# EasyEDA Pro project stm_boy_proj.epro, board pcb
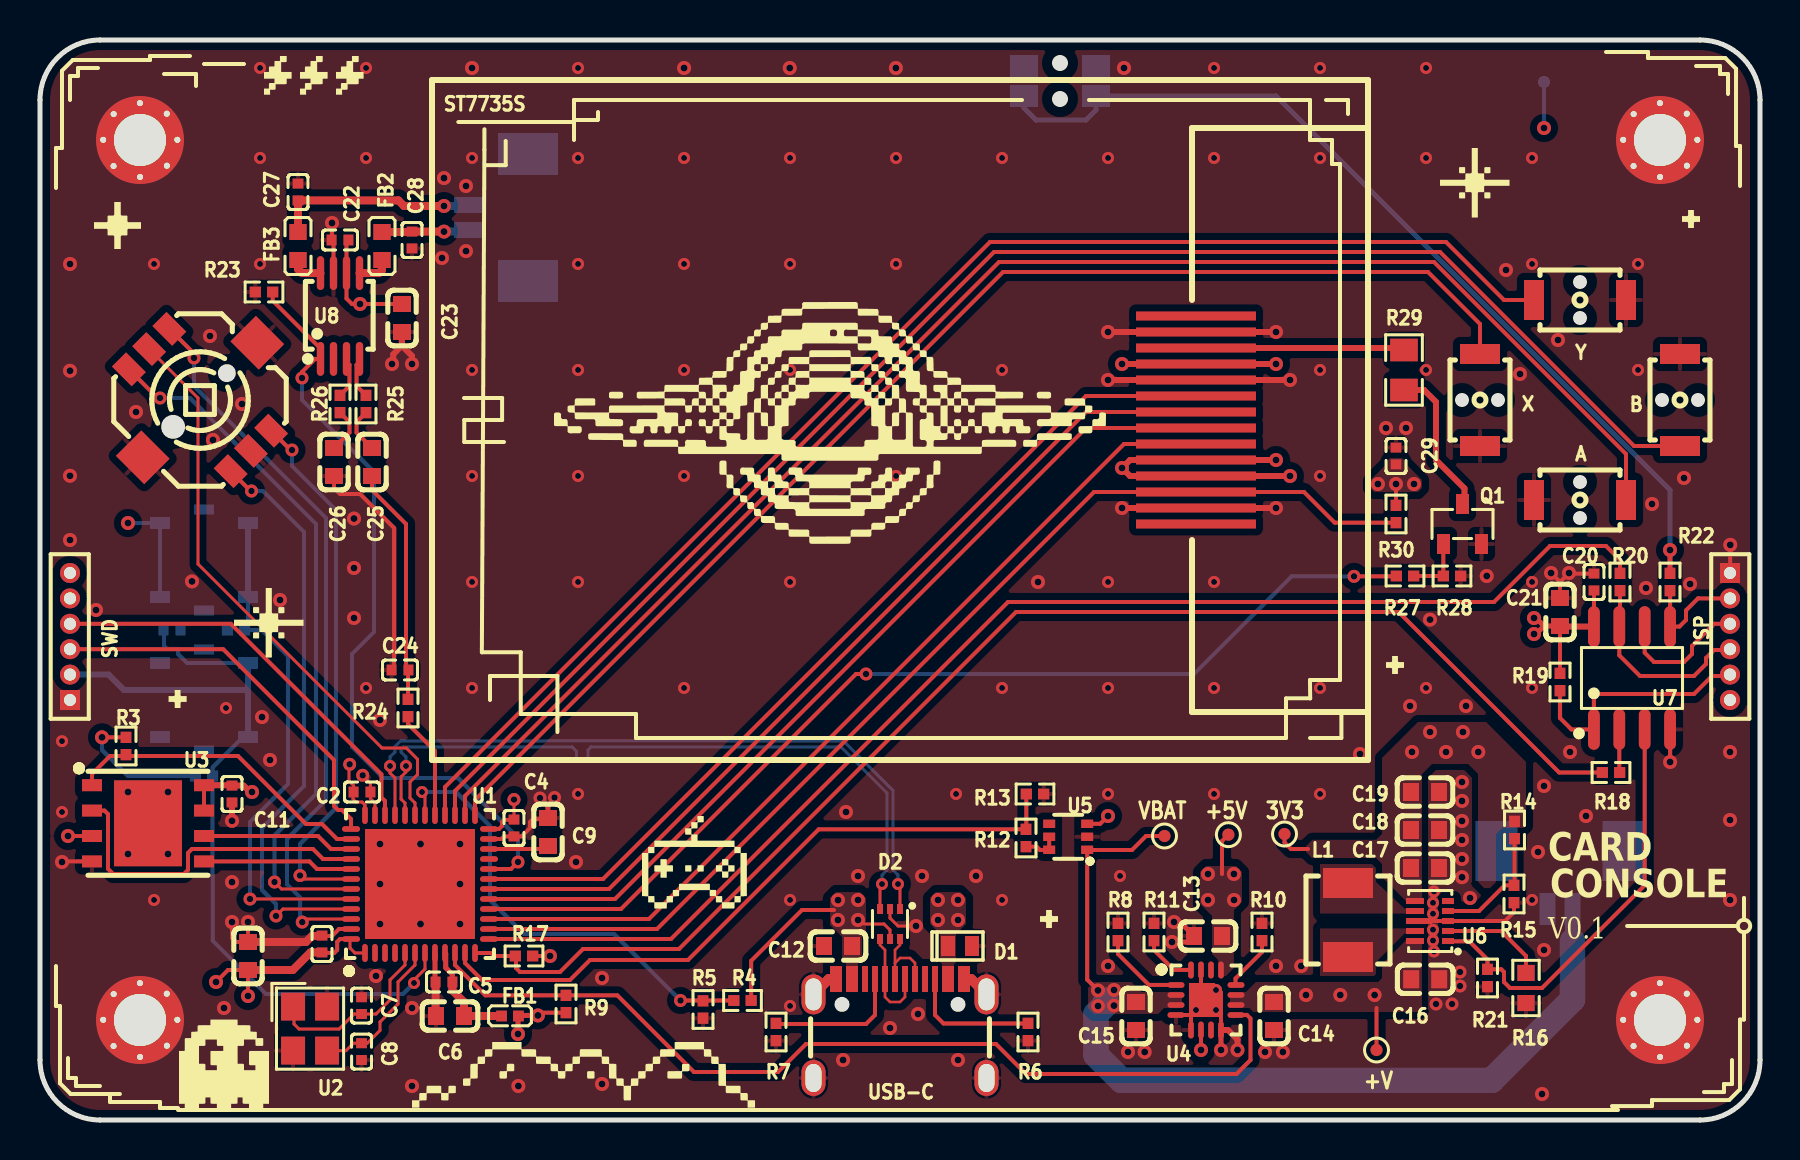
[diagram p3: board, top side]
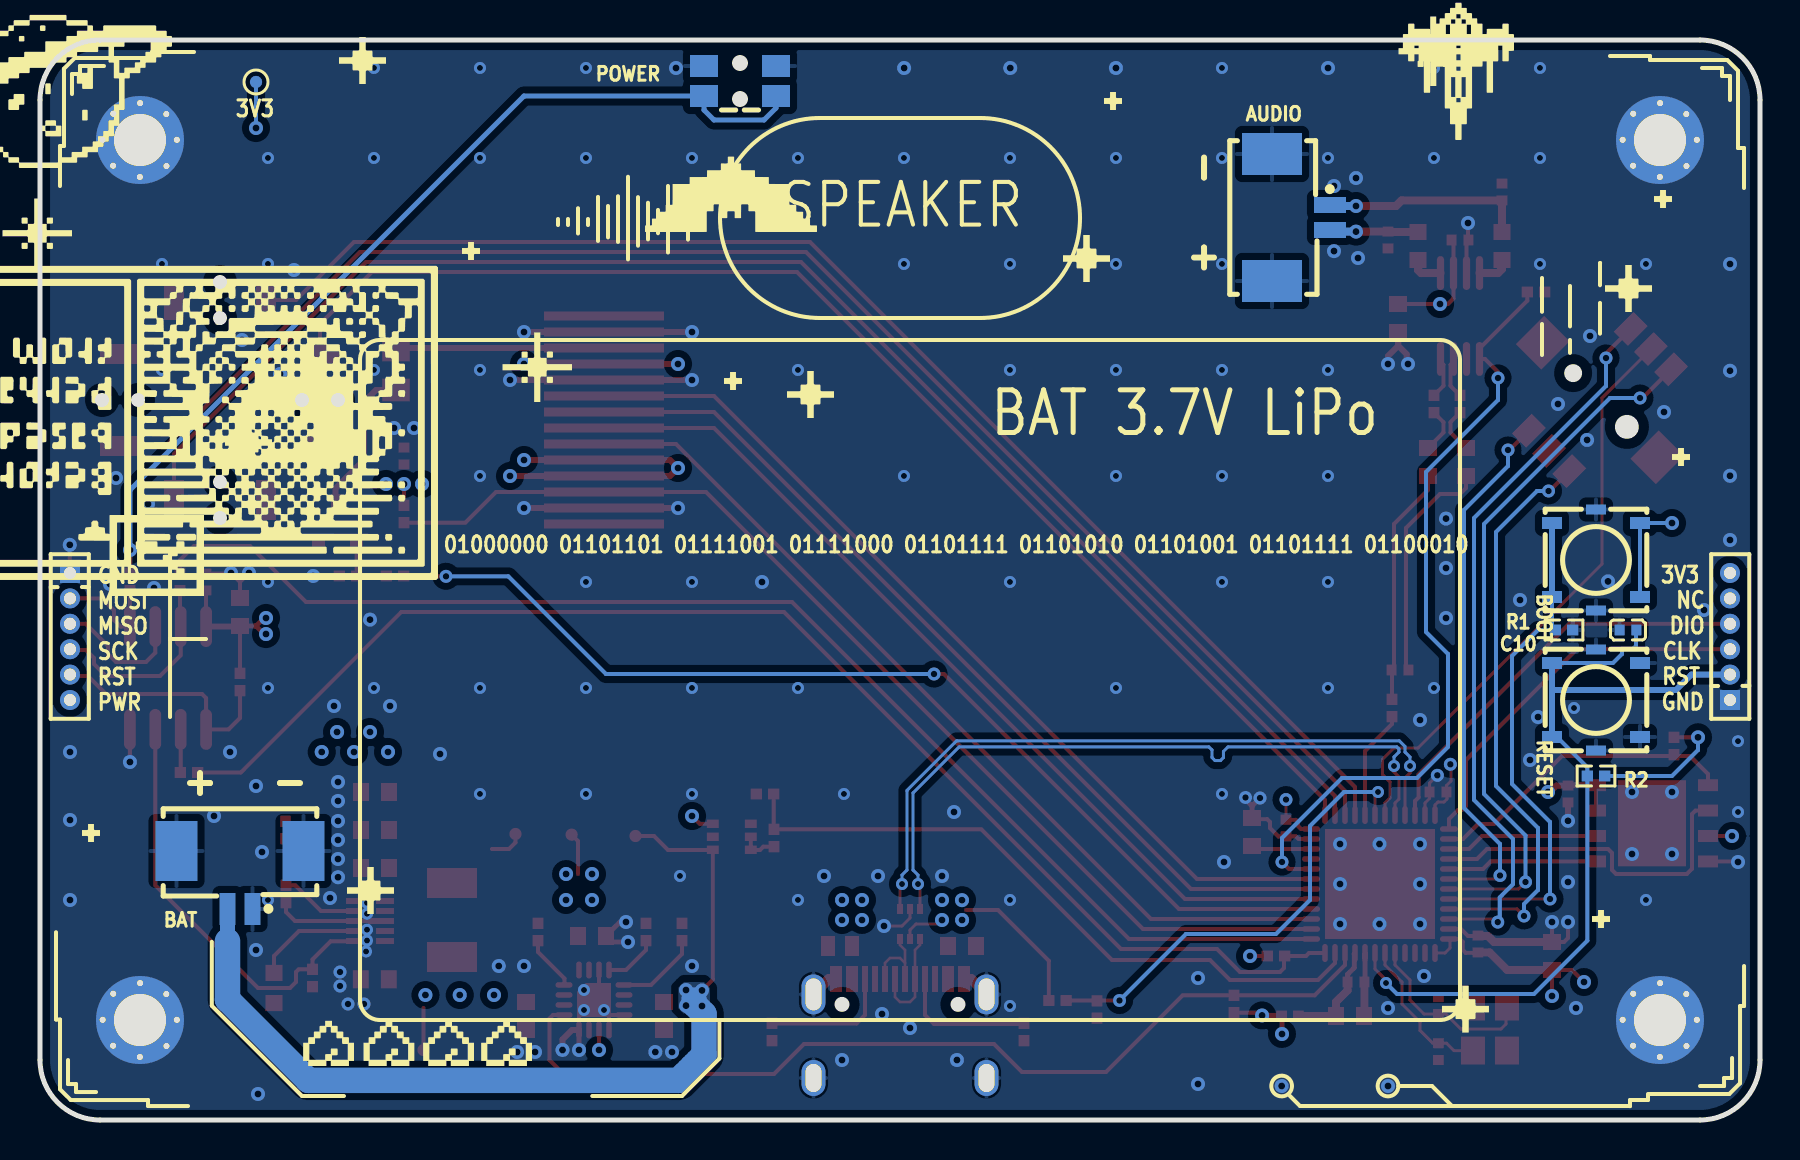
[diagram p4: board, bottom side, seen from below]

Outline 86 x 54 mm; copper layers: Top Layer, Inner1, Inner2, Bottom Layer. Coordinates in mm from the lower left corner of the outline.
Outline path: 0,51 0,3 arc(0.88,0.88) 3,0 83,0 arc(85.12,0.88) 86,3 86,51 arc(85.12,53.12) 83,54 3,54 arc(0.88,53.12) 0,51
Stack: Top Layer 0.018mm Outer layer thickness 1oz / Dielectric1 0.125mm 7628 RC49% 8.6mil / Inner1 0.018mm Inner layer thickness / Dielectric2 1.164mm 1.1mm H/HOZ Copper / Inner2 0.018mm Inner layer thickness / Dielectric3 0.125mm 7628 RC49% 8.6mil / Bottom Layer 0.018mm Outer layer thickness 1oz

## Design rules (mm)
net D+: DP1
net D-: DP1
net $3N1074: DP3
net $3N1073: DP3
net $3N1075: DP4
net $3N1076: DP4
template: User Custom Config
spacing Default (default): track to track 0.125, other pairs 0.13 to 0.4
track width Default (default): min 0.125, default 0.13, max 25.4
differential pair differentialPair (default): width min 0.127, default 0.254, max 2.54; gap min 0.152, default 0.152
via Default (default): diameter min 0.6, default 0.6, max 5; hole min 0.3, default 0.3, max 2

## Placement (name value [footprint] x y rotation side)
A  KAN0444-0201B/102  [SW-SMD_KAN0444-0201B-102]  77 31 180 top
AUDIO  532610271  [CONN-SMD_532610271]  22.95 45.12 90 bottom
B  KAN0444-0201B/102  [SW-SMD_KAN0444-0201B-102]  82 36 90 top
BAT  532610271  [CONN-SMD_532610271]  76 12 180 bottom
BOOT  EVQPLMA15  [KEY-SMD_6P-L4.9-4.9-P3.70]  8.2 28 0 bottom
C1  4.7uF  [C0603]  10.4 8.2 270 top
C2  100nF  [C0402]  16.1 16.4 180 top
C3  100nF  [C0402]  14.1 8.8 270 top
C4  100nF  [C0402]  23.7 14.6 90 top
C5  100nF  [C0402]  20.2 6.9 0 top
C6  1uF  [C0603]  20.5 5.2 180 top
C7  15pF  [C0402]  16.08 5.72 90 top
C8  15pF  [C0402]  16.08 3.42 90 top
C9  4.7uF  [C0603]  25.4 14.4 270 top
C10  100nF  [C0402]  6.6 24.5 180 bottom
C11  100nF  [C0402]  9.6 16.3 270 top
C12  1uF  [C0603]  39.9 8.7 0 top
C13  1uF  [C0603]  58.4 9.2 0 top
C14  4.7uF  [C0603]  61.7 5.2 90 top
C15  4.7uF  [C0603]  54.8 5.2 270 top
C16  10uF  [C0603]  69.26 7.04 180 top
C17  10uF  [C0603]  69.25 12.6 180 top
C18  10uF  [C0603]  69.25 14.5 180 top
C19  10uF  [C0603]  69.25 16.4 180 top
C20  100nF  [C0402]  77.7 26.9 270 top
C21  1uF  [C0603]  76 25.4 270 top
C22  100nF  [C0402]  15 44 0 top
C23  10uF  [C0603]  18.1 40.1 90 top
C24  2.2nF  [C0402]  18 22.5 0 top
C25  1uF  [C0603]  16.6 32.9 90 top
C26  1uF  [C0603]  14.7 32.9 90 top
C27  220pF  [C0402]  12.9 46.4 90 top
C28  220pF  [C0402]  18.6 44 90 top
C29  100nF  [C0402]  67.8 33.2 90 top
D1  ESDA7P60-1U1M  [DFN1610-2L_L1.6-W1.0-P1.10-RD]  46 8.7 0 top
D2  USBLC6-2P6  [SOT-666-6_L1.6-W1.2-P0.50-LS1.6-BL]  42.5 9.8 180 top
FB1  BLM15PX601SN1D  [L0402]  23.5 5.2 180 top
FB2  MPZ1608S101ATAH0  [L0603]  17.1 43.7 90 top
FB3  MPZ1608S101ATAH0  [L0603]  12.9 43.7 90 top
ISP  ISP pads  [6-PIN HEADER SMALL 1.27MM]  84.5 27.35 270 top
L1  470nH  [IND-SMD_L4.4-W4.2_SPM4020T]  65.4 10 90 top
NOREF  -  [Pad_e15262]  56.22 14.2 0 top
NOREF#2  -  [Pad_e15281]  66.83 3.5 0 top
NOREF#3  -  [Pad_e15491]  62.23 14.3 0 top
NOREF#4  -  [Pad_e15184]  75.2 51.9 0 top
NOREF#5  -  [Pad_e15272]  59.42 14.27 0 top
O1  MOUNTING HOLES M2  [MOUNTINGHOLE_2.2MM_M2_PAD_VIA]  5 49 0 top
O2  MOUNTING HOLES M2  [MOUNTINGHOLE_2.2MM_M2_PAD_VIA]  5 5 0 top
O3  MOUNTING HOLES M2  [MOUNTINGHOLE_2.2MM_M2_PAD_VIA]  81 49 0 top
O4  MOUNTING HOLES M2  [MOUNTINGHOLE_2.2MM_M2_PAD_VIA]  81 5 0 top
POWER  EVQP7C01P  [SW-SMD_EVQP7C01P]  51 51.95 0 bottom
Q1  S8050/J3Y/0.4  [SOT-23-3_L2.9-W1.3-P1.90-LS2.4-BR]  71.12 29.8 270 top
R1  10kΩ  [R0402]  9.8 24.5 180 bottom
R2  10kΩ  [R0402]  8.2 17.2 180 bottom
R3  10kΩ  [R0402]  4.3 18.7 270 top
R4  33kΩ  [R0402]  35.12 5.97 0 top
R5  82kΩ  [R0402]  33.15 5.53 90 top
R6  5.1kΩ  [R0402]  49.4 4.4 270 top
R7  5.1kΩ  [R0402]  36.8 4.4 270 top
R8  10kΩ  [R0402]  53.9 9.4 270 top
R9  10kΩ  [R0402]  26.3 5.8 90 top
R10  3.3kΩ  [R0402]  61.1 9.4 270 top
R11  5.1kΩ  [R0402]  55.7 9.4 270 top
R12  33kΩ  [R0402]  49.3 14.1 270 top
R13  82kΩ  [R0402]  49.75 16.3 180 top
R14  56kΩ  [R0402]  73.72 14.5 90 top
R15  10kΩ  [R0402]  73.7 11.3 90 top
R16  0Ω  [R0603]  74.3 6.6 90 top
R17  100kΩ  [R0402]  24.2 8.2 180 top
R18  10kΩ  [R0402]  78.55 17.38 180 top
R19  10kΩ  [R0402]  76 21.9 270 top
R20  10kΩ  [R0402]  79 26.9 90 top
R21  100kΩ  [R0402]  72.38 7.1 90 top
R22  1kΩ  [R0402]  81.5 26.9 270 top
R23  100kΩ  [R0402]  11.2 41.4 180 top
R24  3.3kΩ  [R0402]  18.4 20.6 90 top
R25  10kΩ  [R0402]  16.3 35.8 90 top
R26  10kΩ  [R0402]  15 35.8 90 top
R27  1kΩ  [R0402]  68.25 27.2 0 top
R28  10kΩ  [R0402]  70.6 27.2 0 top
R29  10Ω  [R0805]  68.2 37.5 90 top
R30  10kΩ  [R0402]  67.8 30.3 270 top
RESET  EVQPLMA15  [KEY-SMD_6P-L4.9-4.9-P3.70]  8.2 21 0 bottom
ST7735S  ST7735S_14PIN  [NSP_TFT_1.77_128160_ST7735S_14PIN]  48 35 90 top
SW8  SKRHABE010  [SW-SMD_SKRHABE010]  8 36 315 top
SWD  ST-Link pads  [6-PIN HEADER SMALL 1.27MM]  1.5 21 90 top
U1  STM32F411CEU6  [UFQFPN-48_L7.0-W7.0-P0.50-BL-EP]  19 11.8 0 top
U2  8MHz  [CRYSTAL-SMD_4P-L3.2-W2.5-BL]  13.5 4.57 270 top
U3  W25Q128JVPIQ  [WSON-8_L5.0-W6.0-P1.27-BL-EP]  5.4 14.83 270 top
U4  BQ24075RGTR  [QFN-16_L3.0-W3.0-P0.50-TL-EP1.7]  58.3 6 0 top
U5  TPS22919DCKR  [SC-70-6_L2.2-W1.3-P0.65-LS2.1-BR]  51.41 14.16 0 top
U6  TPS63802DLAR  [VSON-10_L3.0-W2.0-P0.50-TL]  69.57 9.95 180 top
U7  ATTINY13A-SSU  [SOIC-8_L4.9-W3.9-P1.27-LS6.0-BL]  79.6 22.1 0 top
U8  PAM8302AASCR  [MSOP-8_L3.0-W3.0-P0.65-LS5.0-BL]  15 40.2 0 top
USB-C  TYPE-C-31-M-12  [USB-C_SMD-TYPE-C-31-M-12_1]  43 4.57 0 top
X  KAN0444-0201B/102  [SW-SMD_KAN0444-0201B-102]  72 36 270 top
Y  KAN0444-0201B/102  [SW-SMD_KAN0444-0201B-102]  77 41 0 top

## Footprints (pads in the part's own frame, mm; a bottom-side part is the same pattern mirrored in y, then rotated)
6-PIN HEADER SMALL 1.27MM
  rect 1x1 hole 0.605x0.6: 1(0,0)
  round 1 hole 0.605x0.6: 2(1.27,0) 3(2.54,0) 4(3.81,0) 5(5.08,0) 6(6.35,0)
C0402
  rect 0.5x0.54 smd: 1(-0.42,0) 2(0.42,0)
C0603
  rect 0.8x0.9 smd: 1(-0.7,0) 2(0.7,0)
CONN-SMD_532610271
  rect 0.8x1.6 smd: 1(0.625,-1.45) 2(-0.625,-1.45)
  rect 2.1x3 smd: 3(3.175,1.45) 4(-3.175,1.45)
CRYSTAL-SMD_4P-L3.2-W2.5-BL
  rect 1.4x1.2 smd: 1(-1.1,-0.85) 2(1.1,-0.85) 3(1.1,0.85) 4(-1.1,0.85)
DFN1610-2L_L1.6-W1.0-P1.10-RD
  rect 0.7x1 smd: 1(-0.6,0) 2(0.6,0)
IND-SMD_L4.4-W4.2_SPM4020T
  rect 1.5x2.5 smd: 1(-1.85,0) 2(1.85,0)
KEY-SMD_6P-L4.9-4.9-P3.70
  rect 1x0.6 smd: 1(2.2,1.85) 2(-2.2,1.85) 3(-2.2,-1.85) 4(2.2,-1.85)
  rect 1x0.5 smd: 5(0,2.525) 6(0,-2.525)
L0402
  rect 0.54x0.54 smd: 1(-0.42,0) 2(0.42,0)
L0603
  rect 0.8x0.864 smd: 1(-0.7,0) 2(0.7,0)
MOUNTINGHOLE_2.2MM_M2_PAD_VIA
  round 0.61 hole 0.305: 1(-1.841,0.008) 1(-1.323,-1.302) 1(-1.315,1.296) 1(-0.004,1.845) 1(0.005,-1.85) 1(1.339,1.313) 1(1.345,-1.286) 1(1.867,0.009)
  round 4.4 hole 2.6: 1(0,0)
MSOP-8_L3.0-W3.0-P0.65-LS5.0-BL
  oval 0.364x1.692 smd: 1(-0.975,-2.146) 2(-0.325,-2.146) 3(0.325,-2.146) 4(0.975,-2.146) 5(0.975,2.146) 6(0.325,2.146) 7(-0.325,2.146) 8(-0.975,2.146)
NSP_TFT_1.77_128160_ST7735S_14PIN
  rect 0.45x6 smd: 1(5.2,-9.8) 2(4.4,-9.8) 3(3.6,-9.8) 4(2.8,-9.8) 5(2,-9.8) 6(1.2,-9.8) 7(0.4,-9.8) 8(-0.4,-9.8) 9(-1.2,-9.8) 10(-2,-9.8) 11(-2.8,-9.8) 12(-3.6,-9.8) 13(-4.4,-9.8) 14(-5.2,-9.8)
Pad_e15184
  round 0.61 smd far side: TP4(0,0)
Pad_e15262
  round 0.61 smd: TP5(0,0)
Pad_e15272
  round 0.61 smd: TP5(0,0)
Pad_e15281
  round 0.61 smd: TP5(0,0)
Pad_e15491
  round 0.61 smd: TP5(0,0)
QFN-16_L3.0-W3.0-P0.50-TL-EP1.7
  oval 0.85x0.28 smd: 1(-1.5,0.75) 2(-1.5,0.251) 3(-1.5,-0.249) 4(-1.5,-0.75) 9(1.5,-0.75) 10(1.5,-0.249) 11(1.5,0.251) 12(1.5,0.75)
  oval 0.28x0.85 smd: 5(-0.75,-1.5) 6(-0.25,-1.5) 7(0.25,-1.5) 8(0.75,-1.5) 13(0.75,1.5) 14(0.25,1.5) 15(-0.25,1.5) 16(-0.75,1.5)
  custom 1.7x1.7 smd: 17(0,0.001)
R0402
  rect 0.566x0.54 smd: 1(-0.433,0) 2(0.433,0)
R0603
  rect 0.806x0.864 smd: 1(-0.753,0) 2(0.753,0)
R0805
  rect 1.133x1.377 smd: 1(-1,0) 2(1,0)
SC-70-6_L2.2-W1.3-P0.65-LS2.1-BR
  rect 0.6x0.42 smd: 1(0.95,-0.65) 2(0.95,0) 3(0.95,0.65) 4(-0.95,0.65) 5(-0.95,0) 6(-0.95,-0.65)
SOIC-8_L4.9-W3.9-P1.27-LS6.0-BL
  oval 0.588x2.045 smd: 1(-1.905,-2.57) 2(-0.635,-2.57) 3(0.635,-2.57) 4(1.905,-2.57) 5(1.905,2.57) 6(0.635,2.57) 7(-0.635,2.57) 8(-1.905,2.57)
SOT-23-3_L2.9-W1.3-P1.90-LS2.4-BR
  rect 1x0.65 smd: 1(1,-0.95) 2(1,0.95) 3(-1,0)
SOT-666-6_L1.6-W1.2-P0.50-LS1.6-BL
  rect 0.3x0.5 smd: 1(-0.5,-0.75) 2(0,-0.75) 3(0.5,-0.75) 4(0.5,0.75) 5(0,0.75) 6(-0.5,0.75)
SW-SMD_EVQP7C01P
  rect 1.4x1.1 smd: 1(-1.8,0.75) 1`(1.8,0.75) 2(-1.8,-0.75) 2`(1.8,-0.75)
SW-SMD_KAN0444-0201B-102
  rect 1x2 smd: 1(-2.3,0) 2(2.3,0)
SW-SMD_SKRHABE010
  rect 1.4x1 smd: 1(-3.6,1.43) 2(-3.6,0) 3(-3.6,-1.43) 4(3.6,1.43) 5(3.599,0) 6(3.6,-1.43)
  rect 2x1.8 smd: 7(-0.001,4.05) 8(-0.001,-4.05)
UFQFPN-48_L7.0-W7.0-P0.50-BL-EP
  oval 0.28x0.9 smd: 1(-2.751,-3.45) 2(-2.251,-3.45) 3(-1.75,-3.45) 4(-1.25,-3.45) 5(-0.749,-3.45) 6(-0.249,-3.45) 7(0.249,-3.45) 8(0.75,-3.45) 9(1.25,-3.45) 10(1.75,-3.45) 11(2.251,-3.45) 12(2.751,-3.45) 25(2.751,3.449) 26(2.251,3.449) 27(1.75,3.449) 28(1.25,3.449) 29(0.75,3.449) 30(0.249,3.449) 31(-0.249,3.449) 32(-0.749,3.449) 33(-1.25,3.449) 34(-1.75,3.449) 35(-2.251,3.449) 36(-2.751,3.449)
  oval 0.9x0.28 smd: 13(3.45,-2.751) 14(3.45,-2.251) 15(3.45,-1.75) 16(3.45,-1.25) 17(3.45,-0.75) 18(3.45,-0.249) 19(3.45,0.249) 20(3.45,0.749) 21(3.45,1.25) 22(3.45,1.75) 23(3.45,2.251) 24(3.45,2.751) 37(-3.449,2.751) 38(-3.449,2.251) 39(-3.449,1.75) 40(-3.449,1.25) 41(-3.449,0.749) 42(-3.449,0.249) 43(-3.449,-0.249) 44(-3.449,-0.75) 45(-3.449,-1.25) 46(-3.449,-1.75) 47(-3.449,-2.251) 48(-3.449,-2.751)
  rect 5.5x5.5 smd: 49(0,0)
USB-C_SMD-TYPE-C-31-M-12_1
  oval 1.2x2 hole 0.8x1.6: 1(4.325,1.706) 4(-4.325,1.706)
  oval 1.2x1.8 hole 0.8x1.4: 2(4.325,-2.474) 3(-4.325,-2.474)
  custom 0.6x1.3 smd: A1B12(-3.2,2.474) A4B9(-2.4,2.474) B1A12(3.2,2.474) B4A9(2.401,2.474)
  rect 0.3x1.3 smd: A5(-1.25,2.474) A6(-0.25,2.474) A7(0.25,2.474) A8(1.25,2.474) B5(1.75,2.474) B6(0.75,2.474) B7(-0.75,2.474) B8(-1.75,2.474)
VSON-10_L3.0-W2.0-P0.50-TL
  rect 0.6x0.3 smd: 1(-0.825,1) 2(-0.825,0.5) 3(-0.825,0) 4(-0.825,-0.5) 5(-0.825,-1)
  rect 0.9x0.3 smd: 6(0.825,-1) 7(0.825,-0.5) 9(0.825,0.5) 10(0.825,1)
  rect 1.3x0.3 smd: 8(0.625,0)
WSON-8_L5.0-W6.0-P1.27-BL-EP
  rect 0.6x1 smd: 1(-1.905,-2.8) 2(-0.635,-2.8) 3(0.635,-2.8) 4(1.905,-2.8) 5(1.905,2.8) 6(0.635,2.8) 7(-0.635,2.8) 8(-1.905,2.8)
  rect 4.3x3.4 smd: 9(0,0)

## Nets
3V3: BOOT.2 BOOT.3 C1.2 C2.2 C3.2 C4.2 C11.1 C17.2 C18.2 C19.2 C22.2 C23.2 C29.1 FB1.1 NOREF#3.TP5 NOREF#4.TP4 R2.2 R3.1 R9.1 R14.2 R17.1 R30.1 ST7735S.4 ST7735S.10 ST7735S.11 SWD.6 U1.1 U1.24 U1.36 U1.48 U3.3 U3.7 U3.8 U5.3 U6.6 U8.6
+5V: C12.2 C13.2 D1.1 D2.5 NOREF#5.TP5 R4.2 U4.6 U4.13 USB-C.A4B9 USB-C.B4A9
GND: A.2 AUDIO.3 AUDIO.4 B.2 BAT.1 BAT.3 BAT.4 BOOT.5 BOOT.6 C1.1 C2.1 C3.1 C4.1 C5.1 C6.2 C7.2 C8.1 C9.1 C10.1 C11.2 C12.1 C13.1 C14.1 C15.2 C16.1 C17.1 C18.1 C19.1 C20.1 C21.1 C22.1 C23.1 C24.1 C26.1 C27.2 C28.1 C29.2 D1.2 D2.2 ISP.1 O1.1 O2.1 O3.1 O4.1 POWER.2 POWER.2` Q1.2 R1.2 R5.1 R6.2 R7.2 R8.1 R10.1 R11.1 R13.1 R15.1 R16.1 R21.1 R23.2 R28.2 RESET.2 RESET.3 RESET.5 RESET.6 ST7735S.2 ST7735S.5 ST7735S.13 SW8.5 SW8.7 SW8.8 SWD.1 U1.8 U1.23 U1.35 U1.47 U1.49 U2.2 U2.4 U3.4 U3.9 U4.4 U4.5 U4.8 U4.15 U4.17 U5.2 U6.3 U6.8 U7.4 U8.7 USB-C.1 USB-C.2 USB-C.3 USB-C.4 USB-C.A1B12 USB-C.B1A12 X.2 Y.2
VBAT: BAT.2 C15.1 NOREF.TP5 U4.2 U4.3 U5.1
VBUS: R4.1 R5.2 U1.30
+V: C14.2 C16.2 C20.2 C21.2 ISP.6 NOREF#2.TP5 R19.1 U4.10 U4.11 U6.10 U7.8
A_BTN: A.1 U1.26
AMP_SD: R23.1 U1.20 U8.1
AUDIO_PWM: R24.1 U1.29
B_BTN: B.1 U1.27
BAT_STAT: R12.1 R13.2 U1.11
BLK: R27.1 U1.16
BOOT0: BOOT.1 BOOT.4 R1.1 U1.44
CE_BTN: SW8.2 U1.31
CHRG_STAT: R9.2 U1.10 U4.9
CS_D: R30.2 ST7735S.12 U1.14
CS_F: R3.2 U1.38 U3.1
D+: D2.1 U1.33
D-: D2.3 U1.32
DC: ST7735S.7 U1.18
DN: D2.4 USB-C.A7 USB-C.B7
DOWN_BTN: SW8.6 U1.45
DP: D2.6 USB-C.A6 USB-C.B6
EN: R21.2 U6.1 U7.3
ISP_MISO: ISP.3 U7.6
ISP_MOSI: ISP.2 R22.2 U7.5
ISP_RST: ISP.5 R19.2 U7.1
ISP_SCK: ISP.4 R20.1 U7.7
LEFT_BTN: SW8.3 U1.43
MISO_F: U1.40 U3.2
MOSI_D: ST7735S.8 U1.17
MOSI_F: U1.41 U3.5
NRST: C10.2 R2.1 RESET.1 RESET.4 SWD.2 U1.7
OFF_ACK: R20.2 U1.13
OFF_REQ: R17.2 R18.2 U1.12
OSC_IN: C7.1 U1.5 U2.1
OSC_OUT: C8.2 U1.6 U2.3
PWR_BTN: POWER.1 POWER.1` R22.1
RIGHT_BTN: SW8.4 U1.42
RST_D: ST7735S.6 U1.19
SCK_D: ST7735S.9 U1.15
SCK_F: U1.39 U3.6
SWCLK: SWD.3 U1.37
SWDIO: SWD.4 U1.34
UP_BTN: SW8.1 U1.46
VCAP: C9.2 U1.22
VDDA/VREF+: C5.2 C6.1 FB1.2 U1.9
X_BTN: U1.25 X.1
Y_BTN: U1.28 Y.1
$2N4: R14.1 R15.2 U6.4
$2N16: L1.1 U6.9
$2N17: L1.2 U6.7
$2N28: R11.2 U4.16
$2N40: R7.1 USB-C.A5
$2N41: R6.1 USB-C.B5
$2N60: R18.1 U7.2
$2N62: R16.2 U6.2
$2N64: R12.2 U5.5 U5.6
$2N975: R8.2 U4.1
$2N6281: R10.2 U4.12
$3N1044: AUDIO.2 C28.2 FB2.2
$3N1045: AUDIO.1 C27.1 FB3.2
$3N1049: Q1.3 R29.1
$3N1051: Q1.1 R27.2 R28.1
$3N1059: FB2.1 U8.5
$3N1060: FB3.1 U8.8
$3N1062: R29.2 ST7735S.3
$3N1072: C24.2 C25.1 R24.2
$3N1073: C26.2 R26.1
$3N1074: C25.2 R25.1
$3N1075: R25.2 U8.4
$3N1076: R26.2 U8.3

Pads without a net: ST7735S 1 14; SWD 5; U1 2 3 4 21; U4 7 14; U5 4; U6 5; U8 2; USB-C A8 B8

## Via types
v1: diameter 0.7, hole 0.35, Top Layer to Bottom Layer, 165 vias
v2: diameter 0.65, hole 0.325, Top Layer to Bottom Layer, 23 vias
v3: diameter 0.6, hole 0.3, Top Layer to Bottom Layer, 84 vias

## Routing (per net, layer and track width the routed paths; a pad name or vN(x,y) marks a point on that pad's centre or on a via; arc(x,y) is an arc through that point)
3V3: length 74
  Top Layer w0.15: U1.48 15.5,9 15.5,8.6 15.75,8.35 U1.1 ; v2(15.48,17.78) 15.45,17.75 15.45,16.95 15.68,16.72 C2.2 15.65,16.37 15.65,16.05 15.8,15.9 16.1,15.9 16.25,15.75 U1.36 ; C4.2 v2(23.7,16.02)
  Top Layer w0.2: U1.24 22.95,14.55 23.1,14.7 23.1,14.9 23.21,15.01 23.69,15.01 C4.2
  Top Layer w0.201: C23.2 v1(16,40.8) 15.6,40.8 15.33,41.08 U8.6 15.33,43.91 C22.2 ; v1(10.4,6.2) C1.2 9.4,7.5 v1(8.8,6.9) ; 63.4,13.55 62.55,13.55 62.23,13.87 NOREF#3.TP5 ; v1(67.8,31.8) R30.1 ; 4.3,19.13 v1(3.1,19.13) ; R17.1 v1(25.5,8.2) ; U3.3 v1(1.4,14.2) ; 26.3,5.37 25.04,5.37 v1(24.9,5.23) ; 8.2,15.37 8.2,16.64 ; U1.48 15,9.05 14.86,8.91 14.86,8.5 14.72,8.36 14.12,8.36 C3.2 ; 52.36,14.81 53.01,14.81 v1(53.4,15.2)
  Top Layer w0.249: v1(24.9,5.23) 23.95,5.23 FB1.1 23.9,5.18 v1(23.9,4.3)
  Top Layer w0.299: v1(54.1,37.8) ST7735S.4 v1(61.8,37.8) ; v1(62.5,32.2) ST7735S.11 54.5,32.2 v1(54.1,32.6) 54.5,33 ST7735S.10 v1(61.8,33)
  Top Layer w0.3: v1(10.6,16.4) 10.5,16.4 10.18,16.72 C11.1 9.58,16.74 U3.8
  Top Layer w0.4: C3.2 13.52,8.38 12.64,7.5 C1.2
  Bottom Layer w0.201: v1(4.4,29.85) BOOT.3 BOOT.2 ; NOREF#4.TP4 v1(75.2,49.6) ; v1(3.1,19.13) 3.1,18.5 4.4,17.2 R2.2
  vias: v1(66.9,31.8) v1(68.6,18.4) v1(68.7,31.8) v1(69.5,19.4) v1(70.3,18.4) v1(71.15,19.4) v1(71.92,18.4)
+5V: length 12.2
  Top Layer w0.15: 41.2,9.8 42.2,9.8 42.5,9.5 D2.5
  Top Layer w0.201: U4.6 v1(58.05,3.5) ; NOREF#5.TP5 59.1,13.95 59.1,12.3 ; 39.7,10.5 38.1,10.5 35.56,7.96 R4.2
  vias: v1(39.9,10.99) v1(39.9,10) v1(40.9,11) v1(40.9,10) v1(44.9,11) v1(44.9,10) v1(45.9,11) v1(45.9,10) v1(58.4,12.3) v1(58.4,11) v1(59.69,12.3) v1(59.7,11)
GND: length 91.8
  Top Layer w0.15: D2.2 42.5,10.1 42.9,9.7 v1(43.8,9.7) ; U1.35 16.75,15.85 16.52,16.08 C2.1 16.52,16.85 v2(16.13,17.23)
  Top Layer w0.2: U1.23 23.07,14.05 23.2,14.18 C4.1
  Top Layer w0.201: U4.5 57.55,5.25 U4.4 ; v1(10.4,9.9) 10.4,9 ; 10.4,9 10.3,8.9 9.8,8.9 9.6,9.1 v1(9.6,9.9) ; 10.4,9 10.45,8.95 C1.1 ; C4.1 24.08,14.18 24.5,14.6 24.5,14.9 24.64,15.04 25.34,15.04 C9.1 ; U8.7 14.67,43.9 C22.1 14.6,44.02 v1(14.6,44.85) ; 76,26.9 v1(76.45,27.35) 76.48,27.32 C20.1 ; C21.1 76,26.9 v1(75.55,27.35) ; U4.8 59.05,5.25 v3(58.8,5.5) U4.17 ; U4.17 v3(57.8,5.5) ; U4.17 58.05,6.25 U4.15 ; v1(1.1,12.9) 1.13,12.93 U3.4 ; 73.7,10.87 73.7,10.4 73.25,9.95 U6.3 U6.8 ; ISP.1 84.51,27.36 v1(84.51,28.76) ; U1.47 14.95,9.55 14.6,9.2 14.12,9.2 C3.1 ; C26.1 14.7,31.6 15,31.3 16,31.3 17.7,29.6 17.7,22.62 C24.1
  Top Layer w0.203: U7.4 v1(81.5,17.9)
  Top Layer w0.249: C9.1 25.39,15.11 25.39,15.69 25.4,15.7 ; U1.8 19.75,6.93 C5.1 ; 25.4,15.7 v2(25,16.1) ; 25.4,15.7 25.72,16.03 v2(25.72,16.12) ; v1(56.6,8.9) 57.4,8.9 C13.1 57,9.9 v1(56.7,9.9)
  Top Layer w0.25: U4.8 v1(59.05,3.5)
  Top Layer w0.299: v1(54.1,30.6) ST7735S.13 v1(61.8,30.6) ; v1(61.8,39.4) ST7735S.2 v1(53.4,39.4) ; v1(62.5,37) ST7735S.5 v1(53.4,37) ; 18.1,38.7 18.1,39.5 18.09,39.49 18.09,38.71 ; 18.1,38.7 18.09,38.7 18.09,38.71 ; 18.1,38.7 18.6,38.2 v1(18.6,37.8) ; 18.09,38.71 17.66,38.29 17.66,37.86 v1(17.6,37.8) ; v1(59.88,3.5) 59.88,4.03 59.4,4.5 U4.8
  Top Layer w0.3: v1(9.6,14.96) C11.2
  Top Layer w0.399: C5.1 19.78,5.28 19.7,5.2
  Top Layer w0.4: C3.1 14.08,9.2 13.6,9.2 13.3,8.9 C1.1
  Top Layer w0.5: USB-C.B1A12 46.56,7.05 USB-C.1 ; USB-C.A1B12 39.44,7.05 USB-C.4
  vias: v1(1.5,42.8) v1(1.5,37.46) v1(1.5,32.21) v1(1.5,29) v1(2.8,25.5) v1(4.4,16.4) v1(4.4,13.3) v1(4.8,35.4) v1(6.4,16.4) v1(6.4,13.3) v1(7.6,26.93) v1(8.5,39.2) v1(8.64,34) v1(9.2,5.6) v1(9.6,11.9) v1(10.1,35.8) v1(11.1,20.15) v1(11.5,18) v1(12,26) v1(15.7,30.07) v1(15.7,27.6) v1(15.7,25.1) v1(16.8,7.2) v1(17,20) v1(17,13.8) v1(17,11.8) v1(17,9.8) v1(18.6,5.6) v1(18.6,1.7) v1(19.03,13.8) v1(19.03,9.8) v1(20.1,43.1) v1(20.2,47.1) v1(21,13.8) v1(21,11.8) v1(21,9.8) v1(21.3,46.7) v1(21.3,43.44) v1(21.6,52.6) v1(23.92,1.7) v1(26.8,12.9) v1(28.1,7.1) v1(28.1,1.8) v1(32.2,52.6) v1(37.49,52.6) v1(40.15,3) v1(40.3,15.4) v1(40.9,12.2) v1(42.5,4.6) v1(42.79,52.6) v1(43.9,5.3) v1(44.1,12.2) v1(45.9,3) v1(46.8,12.2) v1(49.9,26.9) v1(53.4,7.7) v1(54.2,52.6) v1(54.4,3.4) v1(55.23,3.4) v1(61.25,3.4) v1(61.8,7.7) v1(62.14,3.4) v1(63.06,7.7) v1(66,18.3) v1(67.3,34.6) v1(68.3,34.6) v1(68.5,20.7) v1(69.5,25.02) v1(71.1,16.9) v1(71.1,15.95) v1(71.1,14.95) v1(71.1,14) v1(71.1,13.05) v1(71.1,12.14) v1(71.3,20.7) v1(71.5,11.1) v1(72.34,27.2) v1(73.3,42.5) v1(74,37.3) v1(74.9,13.4) v1(75.1,1.3) v1(75.2,16.7) v1(75.2,8.5) v1(75.9,39) v1(76.5,18.4) v1(77.3,15.2) v1(80.3,26.6) v1(80.6,30.8) v1(82.2,32.1) v1(82.5,26.8) v1(84.5,18.4) v1(84.5,15) v1(84.5,11) v2(69.8,5.8) v2(70.6,5.8) v2(71,7.4) v2(71,6.7) v3(1.1,18.94) v3(1.1,15.4) v3(5.7,42.8) v3(5.7,11) v3(9.3,20.6) v3(11,52.6) v3(11,48.1) v3(11,42.8) v3(16.3,52.6) v3(16.3,48.1) v3(16.3,21.6) v3(21.6,48.1) v3(21.6,37.5) v3(21.6,32.2) v3(21.6,26.9) v3(21.6,21.6) v3(26.9,52.6) v3(26.9,48.1) v3(26.9,42.8) v3(26.9,37.5) v3(26.9,32.2) v3(26.9,26.9) v3(26.9,16.3) v3(32.2,48.1) v3(32.2,42.8) v3(32.2,37.5) v3(32.2,32.2) v3(32.2,21.6) v3(37.5,48.1) v3(37.5,42.8) v3(37.5,37.5) v3(37.5,26.9) v3(37.5,11) v3(37.5,5.7) v3(42.8,48.1) v3(42.8,42.8) v3(42.8,32.2) v3(45.8,16.3) v3(48.1,48.1) v3(48.1,37.5) v3(48.1,21.6) v3(48.1,11) v3(53.4,48.1) v3(53.4,26.9) v3(53.4,21.6) v3(53.4,16.3) v3(54,12.2) v3(58.7,52.6) v3(58.7,48.1) v3(58.7,26.9) v3(58.7,21.6) v3(58.7,16.3) v3(58.8,6.5) v3(64,52.6) v3(64,48.1) v3(64,37.5) v3(64,32.2) v3(64,21.6) v3(64,16.3) v3(69.3,52.6) v3(69.3,48.1) v3(69.3,37.5) v3(69.3,21.6) v3(69.7,11.43) v3(69.65,10.86) v3(69.65,10.31) v3(69.65,9.52) v3(69.65,8.97) v3(69.7,8.43) v3(74.6,48.1) v3(74.6,42.8) v3(74.6,26.9) v3(74.6,21.6) v3(74.6,11) v3(79.9,42.8) v3(79.9,37.5)
VBAT: length 44.9
  Top Layer w0.201: NOREF.TP5 55.3,14.2 54.6,13.5 52.37,13.5 52.36,13.51 52.36,7.02 v1(52.9,6.48)
  Bottom Layer w0.75: 76.62,8.95 BAT.2
  Bottom Layer w1.27: 53.3,6 53.3,5.8 52.8,5.3 52.8,3.25 54.07,1.98 72.58,1.98 76.62,6.03 76.62,8.95
  vias: v1(52.9,5.7) v1(53.7,6.5) v1(53.7,5.72)
VBUS: length 23.3
  Top Layer w0.15: v3(19.1,16.4) 19.25,16.25 U1.30
  Top Layer w0.201: R4.1 33.15,5.97 R5.2 33.13,5.97 v2(32.03,5.97)
  Bottom Layer w0.201: v2(32.03,5.97) 28.7,9.3 24.2,9.3 22.5,11 22.5,14.7 20.8,16.4 v3(19.1,16.4)
+V: length 10.1
  Top Layer w0.201: NOREF#2.TP5 66.83,5.6 ; C21.2 76,22.33 ; C20.2 77.7,24.67 U7.8
  Top Layer w0.249: v1(74.7,24.3) 74.8,24.3 75.2,24.7 ; v1(74.7,25.1) 74.8,25.1 75.2,24.7 ; 75.2,24.7 C21.2
  Top Layer w0.299: U7.8 76.03,24.67 C21.2
  vias: v1(63.3,6.25) v1(65.01,6.25) v1(66.73,6.25)
A_BTN: length 76.3
  Top Layer w0.201: A.1 79.3,33.3 69.7,42.9 47.95,42.9 21.25,16.2 U1.26
AMP_SD: length 39.2
  Top Layer w0.201: U1.20 23.55,12.55 v2(23.9,12.9) ; v2(13.1,37.1) 13.1,37.4 13.75,38.05 U8.1 14.03,38.58 11.63,40.97 11.63,41.4
  Bottom Layer w0.201: v2(23.9,12.9) 23.9,14.1 20.9,17.1 17.15,17.1 15.6,18.65 15.6,23.3 16.7,24.4 16.7,32.4 13.1,36 v2(13.1,37.1)
AUDIO_PWM: length 5.5
  Top Layer w0.201: U1.29 19.75,18.45 18.4,19.8 18.4,20.17
B_BTN: length 77.6
  Top Layer w0.201: B.1 79.7,33.7 70,43.4 47.7,43.4 20.75,16.45 U1.27
BAT_STAT: length 33.8
  Top Layer w0.201: U1.11 21.25,7.85 22.1,7 23.18,7 ; 23.2,7 26.5,7 27.5,8 32.4,8 38.93,14.53 R12.1 49.32,14.55 R13.2
BLK: length 52.3
  Top Layer w0.201: v2(41.3,22.3) 40.8,22.3 29.05,10.55 U1.16 ; R27.1 67.8,27.18 v2(65.7,27.18)
  Bottom Layer w0.201: v2(41.3,22.3) 57.7,22.3 62.58,27.18 v2(65.7,27.18)
BOOT0: length 26.1
  Top Layer w0.15: U1.44 v2(10.5,11.05)
  Bottom Layer w0.201: BOOT.1 10.4,24.67 R1.1 11.1,24.5 12.4,23.2 12.4,16.8 10.5,14.9 v2(10.5,11.05)
  Bottom Layer w0.299: BOOT.1 BOOT.4
CE_BTN: length 29.8
  Top Layer w0.15: U1.31 18.75,15.85 18.5,16.1 18.5,16.9 18.88,17.28 18.88,18.04 18.31,18.6 17.1,18.6 7.9,27.8 7.9,36.1 SW8.2
CHRG_STAT: length 47
  Top Layer w0.201: 59.78,5.25 60.35,5.25 60.53,5.07 60.53,3 59.83,2.3 49.3,2.3 47.8,3.8 38.3,3.8 36.9,2.4 32.7,2.4 28.87,6.23 22.27,6.23 20.75,7.75 U1.10
CS_D: length 55
  Top Layer w0.201: 67.8,29.87 64.73,29.87 63.2,31.4 ST7735S.12 52.7,31.4 30.85,9.55 U1.14
CS_F: length 15.6
  Top Layer w0.201: U3.1 2.6,17.3 3.5,18.2 9.9,18.2 13.3,14.8 14.1,14.8 14.85,14.05 U1.38
D+: length 35.7
  Top Layer w0.15: U1.33 17.75,17.1 17.5,17.35 v3(17.5,17.7) ; D2.1 43,11.7 v3(42.9,11.8)
  Bottom Layer w0.15: v3(17.5,17.7) 17.5,18.15 17.75,18.4 17.75,18.67 18.03,18.96 40.17,18.96 42.65,16.48 42.65,12.5 42.9,12.25 v3(42.9,11.8)
D-: length 35.8
  Top Layer w0.15: D2.3 42,11.7 v3(42.1,11.8) ; v3(18.3,17.7) 18.3,17.4 18.05,17.15 18.05,16.05 18.25,15.85 U1.32
  Bottom Layer w0.15: v3(18.3,17.7) 18.3,18.15 18.05,18.4 18.05,18.55 18.16,18.65 26.6,18.65 26.83,18.43 26.83,18.12 26.98,17.97 27.25,17.97 27.4,18.12 27.4,18.5 27.55,18.65 40.05,18.65 42.35,16.35 42.35,12.5 42.1,12.25 v3(42.1,11.8)
DC: length 45.2
  Top Layer w0.201: U1.18 28.45,11.55 52.3,35.4 ST7735S.7
DN: length 5.1
  Top Layer w0.13: USB-C.A7 43.25,6.15 43,5.9 42.5,5.9 42.25,6.15 USB-C.B7 42.25,8.5 42,8.75 D2.4
DOWN_BTN: length 29.2
  Top Layer w0.15: v2(11.8,10.2) 12.15,10.55 U1.45
  Top Layer w0.201: SW8.6 10.53,31.45 v2(10.57,31.45)
  Bottom Layer w0.201: v2(10.57,31.45) 11.15,31.45 13.2,29.4 13.2,16.7 11.1,14.6 11.1,11.5 11.8,10.8 v2(11.8,10.2)
DP: length 4.1
  Top Layer w0.13: 42.75,7.85 43,8.1 43.5,8.1 43.75,7.85 USB-C.B6 ; 42.75,7.85 USB-C.A6 ; 42.75,7.85 42.75,8.5 43,8.75 D2.6
EN: length 21.3
  Top Layer w0.201: 80.24,19.53 80.24,11.73 75.1,6.6 73.5,6.6 73.2,6.9 73.2,7.4 73.07,7.53 R21.2
  Top Layer w0.203: R21.2 72.38,8.03 71.46,8.94 70.39,8.94
ISP_MISO: length 6.8
  Top Layer w0.201: ISP.3 83.71,24.81 82.6,23.7 82.6,23.3 82.2,22.9 80.7,22.9 80.24,23.36 80.24,24.67
ISP_MOSI: length 5.7
  Top Layer w0.201: ISP.2 82.9,26.08 82.3,25.48 82.3,25 81.97,24.67 U7.5 81.5,26.46 R22.2
ISP_RST: length 11.7
  Top Layer w0.201: U7.1 77.69,21.09 77.9,21.3 82.7,21.3 83.6,22.2 84.08,22.2 84.09,22.19
  Top Layer w0.203: R19.2 76,20.1 76.57,19.53 U7.1
ISP_SCK: length 9.9
  Top Layer w0.201: R20.1 79,24.7 U7.7 78.97,23.23 80,22.2 82.7,22.2 83.3,22.8 83.3,23.1 83.7,23.5 84.46,23.5 ISP.4
LEFT_BTN: length 35.3
  Top Layer w0.15: v2(11.73,11.9) 12.07,11.55 U1.43
  Top Layer w0.201: SW8.3 5.88,36.1 v2(6,36.1)
  Bottom Layer w0.201: v2(11.73,11.9) 11.73,14.23 13.8,16.3 13.8,29.8 7.5,36.1 v2(6,36.1)
MISO_F: length 17.1
  Top Layer w0.201: U3.2 3.22,15.47 3.4,15.3 3.4,12.56 3.66,12.3 7.19,12.3 7.4,12.51 7.4,13.35 7.59,13.55 13.65,13.55 14.15,13.05 U1.40
MOSI_D: length 45.1
  Top Layer w0.201: ST7735S.8 52.3,34.6 28.75,11.05 U1.17
MOSI_F: length 7.5
  Top Layer w0.201: U3.5 13.47,12.93 13.85,12.55 U1.41
NRST: length 42.7
  Top Layer w0.15: U1.7 19.25,7.55 18.7,7 v3(18.7,6.85)
  Bottom Layer w0.201: RESET.4 7.35,22.85 6.9,23.3 6.9,23.56 6.34,23.56 6.2,23.7 6.2,24.48 C10.2 ; v3(18.7,6.85) 18.15,6.3 11.3,6.3 8.63,8.97 8.63,17.63 10.2,19.2 10.25,19.15 RESET.1
  Bottom Layer w0.299: RESET.4 10.4,22.27 ; 10.4,21.5 RESET.1
  Bottom Layer w0.3: 10.4,22.27 10.4,21.5 4.2,21.5 3.43,22.27 SWD.2
OFF_ACK: length 65.6
  Top Layer w0.201: 79,27.33 79,28 78.3,28.7 75.5,28.7 72.7,25.9 48.4,25.9 31.55,9.05 U1.13
OFF_REQ: length 67.9
  Top Layer w0.201: 78.12,17.38 75.96,17.38 67.93,25.4 48.8,25.4 31.95,8.55 27.15,8.55 26,7.4 24,7.4 23.8,7.6 23.8,8.17 R17.2 22.7,8.2 22.55,8.35 U1.12
OSC_IN: length 9.1
  Top Layer w0.15: U1.5 18.25,7.75 17.5,7 17.5,6 16.8,5.3 C7.1 15.71,5.3 14.96,4.55 12.95,4.55 12.7,4.8 12.7,5.62 U2.1
OSC_OUT: length 7.7
  Top Layer w0.15: U2.3 15.3,3.47 15.67,3.84 C8.2 16.36,3.84 17,4.48 17,4.9 17.9,5.8 17.9,6.9 18.75,7.75 U1.6
PWR_BTN: length 46.4
  Top Layer w0.249: v1(81.5,28.5) 81.5,27.33
  Bottom Layer w0.249: v1(81.5,28.5) 81.5,31.5 61.8,51.2 POWER.1` 52.8,50.5 52.3,50 49.8,50 49.2,50.6 POWER.1
RIGHT_BTN: length 27
  Top Layer w0.15: v2(13,12.22) 13.17,12.05 U1.42
  Top Layer w0.201: SW8.4 12.52,33.5 v2(12.6,33.5)
  Bottom Layer w0.201: v2(12.6,33.5) 12.6,32.7 14.8,30.5 14.8,15.6 13,13.8 v2(13,12.22)
RST_D: length 45.4
  Top Layer w0.201: ST7735S.6 52.3,36.2 28.15,12.05 U1.19
SCK_D: length 45.2
  Top Layer w0.201: ST7735S.9 54.2,33.8 30.45,10.05 U1.15
SCK_F: length 7.7
  Top Layer w0.201: U1.39 14.55,13.55 13.9,14.2 U3.6 8.25,14.25
SWCLK: length 19.4
  Top Layer w0.201: SWD.3 9.16,23.54 14.7,18 14.7,15.7 14.9,15.5 15.1,15.5 15.55,15.05 U1.37
SWDIO: length 20.8
  Top Layer w0.201: SWD.4 9.54,24.81 17.07,17.28 17.07,16.13 17.25,15.95 U1.34
UP_BTN: length 36.5
  Top Layer w0.15: U1.46 13.27,10.05 v2(13.11,9.89)
  Top Layer w0.201: v2(7.7,38.1) 7.7,38.32 SW8.1
  Bottom Layer w0.201: v2(7.7,38.1) 7.7,36.7 14.3,30.1 14.3,16 12.35,14.05 12.35,11.79 13.01,11.13 13.01,10 v2(13.11,9.89)
VCAP: length 3
  Top Layer w0.201: U1.22 25.25,13.55 C9.2
VDDA/VREF+: length 5.4
  Top Layer w0.249: U1.9 20.29,8.31 20.29,7.61 20.62,7.28 C5.2
  Top Layer w0.399: FB1.2 C6.1 21.2,5.9 20.62,6.48 C5.2
X_BTN: length 64.5
  Top Layer w0.201: U1.25 21.75,16 48.15,42.4 69.4,42.4 72,39.8 X.1
Y_BTN: length 68.3
  Top Layer w0.201: Y.1 73.2,41 70.3,43.9 47.5,43.9 20.25,16.65 U1.28
$2N4: length 6.2
  Top Layer w0.201: R14.1 73.72,11.76 R15.2 73.23,11.73 71.95,10.45 U6.4
$2N28: length 2.7
  Top Layer w0.201: R11.2 55.7,8.5 56.7,7.5 57.53,7.5
$2N40: length 7
  Top Layer w0.201: 36.8,4.93 36.93,4.8 41.3,4.8 41.75,5.25 USB-C.A5
$2N41: length 6.7
  Top Layer w0.201: USB-C.B5 44.75,5.25 45.18,4.82 49.29,4.82 49.4,4.93
$2N60: length 2.2
  Top Layer w0.201: R18.1 78.98,17.35 79,17.33 ; U7.2 78.97,17.37
$2N62: length 5.3
  Top Layer w0.201: R16.2 74.3,8.2 73.05,9.45 U6.2
$2N64: length 1.9
  Top Layer w0.201: 49.3,13.67 49.83,13.67 50,13.5 50.45,13.5 U5.6 U5.5
$2N975: length 4.2
  Top Layer w0.201: R8.2 53.9,8.3 55.45,6.75 56.78,6.75
$2N6281: length 2.8
  Top Layer w0.201: R10.2 61.1,8.4 59.78,7.08 59.78,6.75
$3N1044: length 4.4
  Top Layer w0.4: v1(20.2,44.42) C28.2 18.58,44.4 FB2.2
  Bottom Layer w0.4: AUDIO.2 21.42,44.42 v1(20.2,44.42)
$3N1045: length 10.3
  Top Layer w0.4: FB3.2 C27.1 17.92,45.98 18.2,45.7 v1(20.2,45.7)
  Bottom Layer w0.4: AUDIO.1 21.45,45.7 v1(20.2,45.7)
$3N1049: length 7.6
  Top Layer w0.299: R29.1 69.2,36.5 69.8,35.9 69.8,33 71.22,31.58 71.22,30.9 Q1.3
$3N1051: length 3.1
  Top Layer w0.201: R27.2 R28.1 70.17,28.79 Q1.1
$3N1059: length 1.7
  Top Layer w0.4: U8.5 16.95,42.35 17.1,42.5 FB2.1
$3N1060: length 1.8
  Top Layer w0.4: 12.9,43.1 12.9,42.55 13.1,42.35 U8.8
$3N1062: length 10.4
  Top Layer w0.299: R29.2 68.1,38.6 ST7735S.3
$3N1072: length 11.9
  Top Layer w0.201: R24.2 18.4,22.38 ; 18.47,22.45 18.52,22.5 ; C25.1 16.6,31.5 18.3,29.8 18.3,22.62 C24.2
$3N1073: length 2.3
  Top Layer w0.201: C26.2 15.47,34.37 15.47,34.89 15,35.37
$3N1074: length 2.3
  Top Layer w0.201: C25.2 15.83,34.37 15.83,34.89 16.3,35.37
$3N1075: length 2.1
  Top Layer w0.201: R25.2 15.83,36.71 15.83,37.76 15.97,37.91 U8.4
$3N1076: length 2.1
  Top Layer w0.201: R26.2 15.47,36.71 15.47,37.76 15.33,37.91 U8.3

## Copper pours and planes (outline as drawn; the poured copper is in the pictures)
3V3 on Top Layer: 66.5,33.1 69.1,33.1 69.1,31.4 66.5,31.4
3V3 on Top Layer: 63.3,19.9 74.3,19.9 74.3,10.8 63.3,10.8
3V3 on Inner2: 0.4,53.6 85.6,53.6 85.6,0.4 0.4,0.4
+5V on Top Layer: 44.5,11.4 46.3,11.4 46.3,7.15 44.5,7.15
+5V on Top Layer: 58,12.7 60.1,12.7 60.1,7.2 58,7.2
+5V on Top Layer: 39.5,11.4 41.3,11.4 41.3,7.05 39.5,7.05
+5V on Inner2: 36,14 62.31,14 62.31,0.7 36,0.7
GND on Top Layer: 69.4,17.5 71.6,17.5 71.6,5.3 69.4,5.3
GND on Top Layer: 0,51 0.01,51.26 0.06,51.61 0.15,51.94 0.28,52.27 0.45,52.57 0.65,52.86 0.88,53.12 1.14,53.35 1.43,53.55 1.73,53.72 2.06,53.85 2.39,53.94 2.74,53.99 3,54 83,54 83.26,53.99 83.61,53.94 83.94,53.85 84.27,53.72 84.57,53.55 84.86,53.35 85.12,53.12 85.35,52.86 85.55,52.57 85.72,52.27 85.85,51.94 85.94,51.61 85.99,51.26 86,51 86,3 85.99,2.74 85.94,2.39 85.85,2.06 85.72,1.73 85.55,1.43 85.35,1.14 85.12,0.88 84.86,0.65 84.57,0.45 84.27,0.28 83.94,0.15 83.61,0.06 83.26,0.01 83,0 3,0 2.74,0.01 2.39,0.06 2.06,0.15 1.73,0.28 1.43,0.45 1.14,0.65 0.88,0.88 0.65,1.14 0.45,1.43 0.28,1.73 0.15,2.06 0.06,2.39 0.01,2.74 0,3
GND on Bottom Layer: 0.1,50.88 0.11,51.14 0.16,51.48 0.25,51.82 0.38,52.14 0.55,52.45 0.75,52.74 0.98,53 1.24,53.23 1.53,53.43 1.83,53.59 2.16,53.72 2.49,53.81 2.84,53.86 3.1,53.88 83.1,53.88 83.36,53.86 83.71,53.81 84.04,53.72 84.37,53.59 84.67,53.43 84.96,53.23 85.22,53 85.45,52.74 85.65,52.45 85.82,52.14 85.95,51.82 86.04,51.48 86.09,51.14 86.1,50.88 86.1,2.88 86.09,2.61 86.04,2.27 85.95,1.93 85.82,1.61 85.65,1.3 85.45,1.01 85.22,0.75 84.96,0.52 84.67,0.32 84.37,0.16 84.04,0.03 83.71,-0.06 83.36,-0.11 83.1,-0.12 3.1,-0.12 2.84,-0.11 2.49,-0.06 2.16,0.03 1.83,0.16 1.53,0.32 1.24,0.52 0.98,0.75 0.75,1.01 0.55,1.3 0.38,1.61 0.25,1.93 0.16,2.27 0.11,2.61 0.1,2.88
GND on Inner1: 37.31,6.78 38.58,6.78 38.58,5.78 37.31,5.78
GND on Inner1: 37.36,2.55 38.53,2.55 38.53,1.65 37.36,1.65
GND on Inner1: 0.4,53.6 85.6,53.6 85.6,0.4 0.4,0.4
GND on Inner1: 38.82,2.55 39.99,2.55 39.99,1.65 38.82,1.65
GND on Inner1: 47.47,2.55 48.64,2.55 48.64,1.65 47.47,1.65
GND on Inner1: 46.01,2.55 47.18,2.55 47.18,1.65 46.01,1.65
GND on Inner1: 47.42,6.78 48.69,6.78 48.69,5.78 47.42,5.78
VBAT on Top Layer: 52.4,6.9 57.1,6.9 57.1,5.3 52.4,5.3
VBAT on Bottom Layer: 52.5,6.9 54.09,6.9 54.09,5.32 52.5,5.32
+V on Top Layer: 67.1,9.1 69.1,9.1 69.1,5.4 67.1,5.4
+V on Top Layer: 59.5,7.1 67.1,7.1 67.1,5.4 59.5,5.4
+V on Inner2: 59.35,28.17 85.35,28.17 85.35,0.57 59.35,0.57
$2N16 on Top Layer: 64,9.58 68.5,9.58 68.5,7.2 64,7.2
$2N17 on Top Layer: 64,12.8 68.5,12.8 68.5,10.32 64,10.32

Small or netless copper shapes (teardrops, artwork), in the pictures only: 8 on Inner1, 5 on Inner2

## Text on the board
Bottom Silkscreen Layer: 01000000 01101101 01111001 01111000 01101111 01101010 01101001 01101111 01100010 | 3V3 | GND | MOSI | MISO | SCK | RST | PWR | NC | DIO | CLK | SPEAKER | BAT 3.7V LiPo
Top Silkscreen Layer: VBAT | +5V | 3V3 | +V | V0.1 | CARD | CONSOLE
